# Altium project PCB_Project.PrjPcb
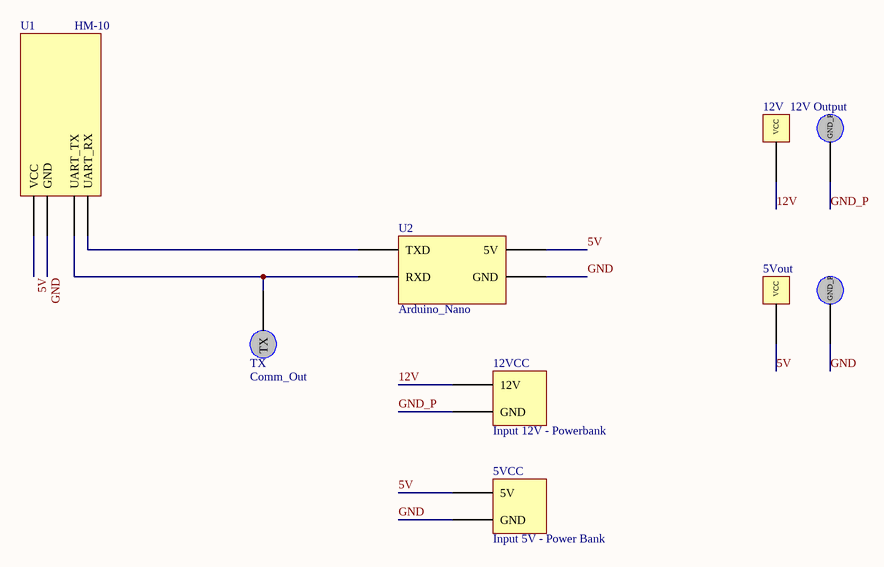
[diagram p0: MYO-BT.SchDoc]
1 sheet, 7 parts. Net scope: global (net labels, ports and power ports of the same name join across sheets).
Board file: MYO-BT.PcbDoc

## Sheet MYO-BT.SchDoc
size A

### Parts
5VCC  Input 5V - Power Bank  [5VCC]
5Vout  12V Output  [Vout]  (value not drawn)
12V  12V Output  [Vout]
12VCC  Input 12V - Powerbank  [12VCC]
TX  Comm_Out  [Comm_Out]
U1  HM-10  [HM-10]
U2  Arduino_Nano  [Arduino Nano]

### Nets
5V: 5VCC.1(5V) 5Vout.1(VCC) U1.1(VCC) U2.5V
12V: 12V.1(VCC) 12VCC.1(12V)
GND: 5VCC.2(GND) 5Vout.2(GND_P) U1.2(GND) U2.GND
GND_P: 12V.2(GND_P) 12VCC.2(GND)
NetTX_1: TX.1(TX) U1.3(UART_TX) U2.RXD
NetU1_4: U1.4(UART_RX) U2.TXD

### Library data of the parts
U1 = HM-10_Basic: HM-10, just with necessary pins for this application
U2 = Arduino_Nano_Basic: Arduino Nano with only the necessary pins for this application.